# EAGLE schematic ROT_POT (EAGLE 7.5.0)
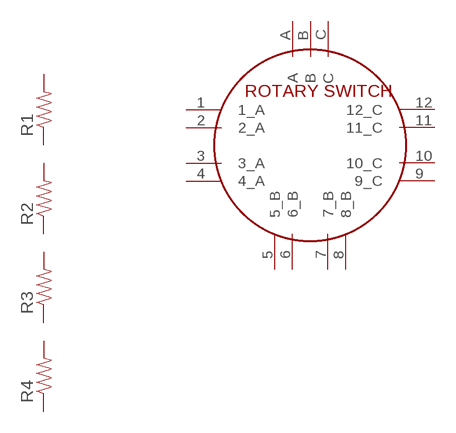
[diagram p0: schematic, sheet 1]

## Parts
R1  RESISTORAXIAL-0.3  [AXIAL-0.3]
R2  RESISTORAXIAL-0.3  [AXIAL-0.3]
R3  RESISTORAXIAL-0.3  [AXIAL-0.3]
R4  RESISTORAXIAL-0.3  [AXIAL-0.3]
U$1  ROTARY_SWITCH  [ROTARY_SWITCH]
Unconnected: R1.P$1 R1.P$2 R2.P$1 R2.P$2 R3.P$1 R3.P$2 R4.P$1 R4.P$2 U$1.1(1_A) U$1.2(2_A) U$1.3(3_A) U$1.4(4_A) U$1.5(5_B) U$1.6(6_B) U$1.7(7_B) U$1.8(8_B) U$1.9(9_C) U$1.10(10_C) U$1.11(11_C) U$1.12(12_C) U$1.A U$1.B U$1.C

## Library data of the parts
R1-R4 = SparkFun-Resistors:RESISTOR: Resistor Basic schematic elements and footprints for 0603, 1206, and PTH resistors.
U$1 = RodrigoMarques_Parts:ROTARY_SWITCH